# Altium project Computer_Board.PrjPcb (part 3 of 3)
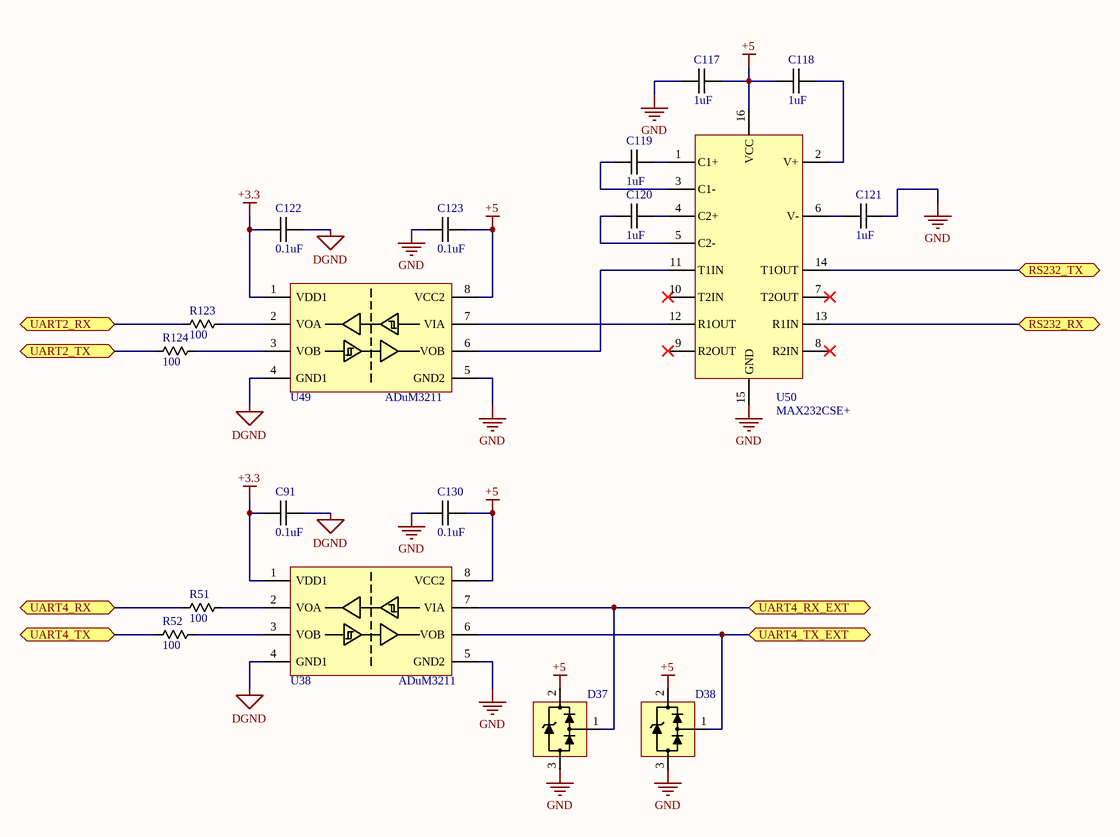
[diagram p13: SCH13_RS232.SchDoc]

## Nets that join several sheets
+3.3: SCH1_Power (C17.1 C18.1 L4.2 R7.1), SCH2_Main_Computer (12 pins), SCH3_Main_Computer_Eth (13 pins), SCH4_Main_Computer_USB (U13.5 U16.5), SCH5_Main_computer_USB2-0 (U20.5 U21.5 U22.5 U23.5), SCH6_Main_computer_Display (9 pins), SCH7_Main_Computer_PCIe (12 pins), SCH8_BBB (17 pins), SCH9_BBB_Eth (5 pins), SCH10_BBB_USB (C86.1 R81.1 U34.5), SCH11_Digital_IO (21 pins), SCH12_AFE (C95.2 C102.2 U43.5 U44.1), SCH13_RS232 (C91.2 C122.2 U38.1 U49.1)
+5: SCH1_Power (10 pins), SCH11_Digital_IO (22 pins), SCH12_AFE (23 pins), SCH13_RS232 (9 pins)
+5_SBY: SCH1_Power (5 pins), SCH2_Main_Computer (J3.B84 J3.B85 J3.B86 J3.B87), SCH4_Main_Computer_USB (C32.2 R27.1 R28.1 U14.2), SCH5_Main_computer_USB2-0 (C38.2 C39.2 U18.2 U19.2), SCH6_Main_computer_Display (F2.2 R39.2 R42.2), SCH8_BBB (MOD1.A4 MOD1.A5 MOD1.B5), SCH10_BBB_USB (C83.1 U33.2)
+12: SCH1_Power (6 pins), SCH2_Main_Computer (13 pins)
DGND: SCH1_Power (29 pins), SCH2_Main_Computer (49 pins), SCH3_Main_Computer_Eth (11 pins), SCH4_Main_Computer_USB (25 pins), SCH5_Main_computer_USB2-0 (28 pins), SCH6_Main_computer_Display (28 pins), SCH7_Main_Computer_PCIe (15 pins), SCH8_BBB (58 pins), SCH9_BBB_Eth (21 pins), SCH10_BBB_USB (12 pins), SCH11_Digital_IO (21 pins), SCH12_AFE (5 pins), SCH13_RS232 (C91.1 C122.1 U38.4 U49.4)
GND: SCH1_Power (42 pins), SCH11_Digital_IO (19 pins), SCH12_AFE (39 pins), SCH13_RS232 (9 pins)
ADC_1_~{CS}: SCH11_Digital_IO (U37.14), SCH12_AFE (U43.1 U44.6)
AFE_MUX_0: SCH8_BBB (MOD1.159), SCH12_AFE (U44.7)
AFE_MUX_1: SCH8_BBB (MOD1.158), SCH12_AFE (U44.8)
BBB_I2C_SCL: SCH8_BBB (MOD1.72), SCH11_Digital_IO (R109.1 U40.3)
BBB_I2C_SDA: SCH8_BBB (MOD1.71), SCH11_Digital_IO (R108.1 U40.2)
BBB_SYS_RSTn: SCH8_BBB (MOD1.48), SCH9_BBB_Eth (U31.19)
BBB_USB1_D_N: SCH8_BBB (MOD1.92), SCH10_BBB_USB (T11.4)
BBB_USB1_D_P: SCH8_BBB (MOD1.91), SCH10_BBB_USB (T11.1)
BBB_USB1_VBUS: SCH8_BBB (MOD1.109), SCH10_BBB_USB (C84.1 C85.2 L21.2 U33.7)
CAN_RX: SCH8_BBB (MOD1.74), SCH11_Digital_IO (U35.3)
CAN_TX: SCH8_BBB (MOD1.73), SCH11_Digital_IO (U35.6)
CANH: SCH1_Power (J2.B5), SCH11_Digital_IO (D24.2 R84.1 U35.13)
CANL: SCH1_Power (J2.B6), SCH11_Digital_IO (D25.2 R87.2 U35.12)
CB_RESET#: SCH2_Main_Computer (J3.B50), SCH6_Main_computer_Display (R37.1), SCH7_Main_Computer_PCIe (U28.6)
CRITICAL_TEMP: SCH8_BBB (MOD1.153), SCH11_Digital_IO (R106.2 U41.6)
CRS_DV: SCH8_BBB (MOD1.28), SCH9_BBB_Eth (RN2.2)
CS_MUX_0: SCH8_BBB (MOD1.150), SCH11_Digital_IO (R94.1 U37.1)
CS_MUX_1: SCH8_BBB (MOD1.149), SCH11_Digital_IO (R95.1 U37.2)
CS_MUX_2: SCH8_BBB (MOD1.148), SCH11_Digital_IO (R96.1 U37.3)
DDC_AUX_SEL: SCH2_Main_Computer (J3.B95), SCH6_Main_computer_Display (R43.1)
EN_USB_5V: SCH4_Main_Computer_USB (6 pins), SCH5_Main_computer_USB2-0 (U18.3 U18.4 U19.3 U19.4)
ESTOP_IN_24V: SCH1_Power (J2.B21), SCH12_AFE (R105.2)
ESTOP_STATE: SCH8_BBB (MOD1.137), SCH12_AFE (U44.9)
ETH_CT: SCH2_Main_Computer (J3.A14), SCH3_Main_Computer_Eth (5 pins)
EXCD0_PERST#: SCH2_Main_Computer (J3.A48), SCH7_Main_Computer_PCIe (R47.1)
GBE_ACT#: SCH2_Main_Computer (J3.B2), SCH3_Main_Computer_Eth (R26.2 U11.3 U11.6)
HDMIX_CTRLCLK: SCH2_Main_Computer (J3.B98), SCH6_Main_computer_Display (R41.2 U25.7)
HDMIX_CTRLDATA: SCH2_Main_Computer (J3.B99), SCH6_Main_computer_Display (R38.2 U25.6)
HDMIX_HPD: SCH2_Main_Computer (J3.B89), SCH6_Main_computer_Display (R35.2)
I2C_SCL_EXT: SCH1_Power (J2.B23), SCH11_Digital_IO (D33.1 U40.6)
I2C_SDA_EXT: SCH1_Power (J2.B22), SCH11_Digital_IO (D32.1 U40.7)
LD_CELL_A_GND: SCH1_Power (J2.A15), SCH12_AFE (J14.2 U48.4)
LD_CELL_A_PWR: SCH1_Power (J2.C15 J2.C16), SCH12_AFE (F8.2 U46.4)
LD_CELL_A_REF: SCH1_Power (J2.B15), SCH12_AFE (R111.2)
LD_CELL_A_SNS: SCH1_Power (J2.B16), SCH12_AFE (R113.2)
LD_CELL_B_GND: SCH1_Power (J2.A17), SCH12_AFE (J15.2 U48.5)
LD_CELL_B_PWR: SCH1_Power (J2.C17 J2.C18), SCH12_AFE (F9.2 U46.5)
LD_CELL_B_REF: SCH1_Power (J2.B17), SCH12_AFE (R116.2)
LD_CELL_B_SNS: SCH1_Power (J2.B18), SCH12_AFE (R118.2)
LIMIT_1: SCH1_Power (J2.B7), SCH11_Digital_IO (R85.2)
LIMIT_2: SCH1_Power (J2.B8), SCH11_Digital_IO (R86.2)
LIMIT_3: SCH1_Power (J2.B9), SCH11_Digital_IO (R88.2)
LIMIT_4: SCH1_Power (J2.B10), SCH11_Digital_IO (R89.2)
LIMIT_5: SCH1_Power (J2.B11), SCH11_Digital_IO (R97.2)
LIMIT_6: SCH1_Power (J2.B12), SCH11_Digital_IO (R98.2)
LIMIT_7: SCH1_Power (J2.B13), SCH11_Digital_IO (R99.2)
LIMIT_8: SCH1_Power (J2.B14), SCH11_Digital_IO (R100.2)
LIMIT_SIG_1: SCH8_BBB (MOD1.37), SCH11_Digital_IO (R93.1 U36.9)
LIMIT_SIG_2: SCH8_BBB (MOD1.139), SCH11_Digital_IO (R92.1 U36.11)
LIMIT_SIG_3: SCH8_BBB (MOD1.160), SCH11_Digital_IO (R91.1 U36.13)
LIMIT_SIG_4: SCH8_BBB (MOD1.88), SCH11_Digital_IO (R90.1 U36.15)
LIMIT_SIG_5: SCH8_BBB (MOD1.86), SCH11_Digital_IO (R101.1 U39.15)
LIMIT_SIG_6: SCH8_BBB (MOD1.76), SCH11_Digital_IO (R102.1 U39.13)
LIMIT_SIG_7: SCH8_BBB (MOD1.163), SCH11_Digital_IO (R103.1 U39.11)
LIMIT_SIG_8: SCH8_BBB (MOD1.138), SCH11_Digital_IO (R104.1 U39.9)
LINK100#: SCH2_Main_Computer (J3.A4), SCH3_Main_Computer_Eth (R23.2 U8.2 U10.1)
LINK1000#: SCH2_Main_Computer (J3.A5), SCH3_Main_Computer_Eth (R24.2 U9.2 U10.3)
LINK#: SCH2_Main_Computer (J3.A8), SCH3_Main_Computer_Eth (R25.2 U10.6)
MDI0_N: SCH2_Main_Computer (J3.A12), SCH3_Main_Computer_Eth (J5.10 U7.5 U7.6)
MDI0_P: SCH2_Main_Computer (J3.A13), SCH3_Main_Computer_Eth (J5.11 U7.4 U7.7)
MDI1_N: SCH2_Main_Computer (J3.A9), SCH3_Main_Computer_Eth (J5.5 U7.2 U7.9)
MDI1_P: SCH2_Main_Computer (J3.A10), SCH3_Main_Computer_Eth (J5.4 U7.1 U7.10)
MDI2_N: SCH2_Main_Computer (J3.A6), SCH3_Main_Computer_Eth (J5.2 U6.2 U6.9)
MDI2_P: SCH2_Main_Computer (J3.A7), SCH3_Main_Computer_Eth (J5.3 U6.1 U6.10)
MDI3_N: SCH2_Main_Computer (J3.A2), SCH3_Main_Computer_Eth (J5.9 U6.5 U6.6)
MDI3_P: SCH2_Main_Computer (J3.A3), SCH3_Main_Computer_Eth (J5.8 U6.4 U6.7)
MDIO_CLK: SCH8_BBB (MOD1.20), SCH9_BBB_Eth (U31.17)
MDIO_DATA: SCH8_BBB (MOD1.19), SCH9_BBB_Eth (R73.2 U31.16)
MII1_COL: SCH8_BBB (MOD1.12), SCH9_BBB_Eth (RN2.3)
OVER_TEMP: SCH8_BBB (MOD1.134), SCH11_Digital_IO (R107.2 U41.5)
PCIE_CLK_N: SCH2_Main_Computer (J3.A88), SCH7_Main_Computer_PCIe (J10.49)
PCIE_CLK_P: SCH2_Main_Computer (J3.A89), SCH7_Main_Computer_PCIe (J10.47)
PCIE_CLKREQ0#: SCH2_Main_Computer (J3.A49), SCH7_Main_Computer_PCIe (J10.53)
PCIE_RX0_N: SCH2_Main_Computer (J3.B68), SCH7_Main_Computer_PCIe (J10.41)
PCIE_RX0_P: SCH2_Main_Computer (J3.B69), SCH7_Main_Computer_PCIe (J10.43)
PCIE_TX0_N: SCH2_Main_Computer (J3.A68), SCH7_Main_Computer_PCIe (J10.35)
PCIE_TX0_P: SCH2_Main_Computer (J3.A69), SCH7_Main_Computer_PCIe (J10.37)
PCIE_WAKE0#: SCH2_Main_Computer (J3.B66), SCH7_Main_Computer_PCIe (J10.55 R46.2)
PORT_POT_GND: SCH1_Power (J2.A19), SCH12_AFE (J16.2 U48.6)
PORT_POT_PWR: SCH1_Power (J2.C19), SCH12_AFE (F10.2 U46.6)
PORT_POT_SNS: SCH1_Power (J2.B19), SCH12_AFE (R119.2)
RS232_RX: SCH1_Power (J2.C22), SCH13_RS232 (U50.13)
RS232_TX: SCH1_Power (J2.C21), SCH13_RS232 (U50.14)
RX_DV: SCH8_BBB (MOD1.9), SCH9_BBB_Eth (R74.1)
RXCLK: SCH8_BBB (MOD1.6), SCH9_BBB_Eth (R75.1)
RXD0: SCH8_BBB (MOD1.21), SCH9_BBB_Eth (RN1.4)
RXD1: SCH8_BBB (MOD1.22), SCH9_BBB_Eth (RN1.3)
RXD2: SCH8_BBB (MOD1.4), SCH9_BBB_Eth (RN1.2)
RXD3: SCH8_BBB (MOD1.5), SCH9_BBB_Eth (RN1.1)
RXERR: SCH8_BBB (MOD1.27), SCH9_BBB_Eth (RN2.1)
SMB_ALERT#: SCH2_Main_Computer (J3.B15), SCH7_Main_Computer_PCIe (R50.1)
SMB_CLK: SCH2_Main_Computer (J3.B13), SCH7_Main_Computer_PCIe (R49.1)
SMB_DATA: SCH2_Main_Computer (J3.B14), SCH7_Main_Computer_PCIe (R48.1)
SPI_CLK: SCH8_BBB (MOD1.103 P4.2), SCH11_Digital_IO (U41.1), SCH12_AFE (U44.3)
SPI_CS0: SCH8_BBB (MOD1.106), SCH11_Digital_IO (U37.4 U37.5)
SPI_CS_EXT: SCH8_BBB (P4.5), SCH11_Digital_IO (U37.15)
SPI_MISO: SCH8_BBB (MOD1.104 P4.4), SCH11_Digital_IO (U41.2), SCH12_AFE (U43.4)
SPI_MOSI: SCH8_BBB (MOD1.105 P4.3), SCH11_Digital_IO (U41.3), SCH12_AFE (U44.4)
STBD_POT_GND: SCH1_Power (J2.A20), SCH12_AFE (J17.2 U48.7)
STBD_POT_PWR: SCH1_Power (J2.C20), SCH12_AFE (F11.2 U46.7)
STBD_POT_SNS: SCH1_Power (J2.B20), SCH12_AFE (R122.2)
TMDSX_CLK_N: SCH2_Main_Computer (J3.B82), SCH6_Main_computer_Display (C51.1)
TMDSX_CLK_P: SCH2_Main_Computer (J3.B81), SCH6_Main_computer_Display (C50.1)
TMDSX_DATA0_N: SCH2_Main_Computer (J3.B76), SCH6_Main_computer_Display (C53.1)
TMDSX_DATA0_P: SCH2_Main_Computer (J3.B75), SCH6_Main_computer_Display (C52.1)
TMDSX_DATA1_N: SCH2_Main_Computer (J3.B74), SCH6_Main_computer_Display (C57.1)
TMDSX_DATA1_P: SCH2_Main_Computer (J3.B73), SCH6_Main_computer_Display (C56.1)
TMDSX_DATA2_N: SCH2_Main_Computer (J3.B72), SCH6_Main_computer_Display (C59.1)
TMDSX_DATA2_P: SCH2_Main_Computer (J3.B71), SCH6_Main_computer_Display (C58.1)
TXCLK: SCH8_BBB (MOD1.23), SCH9_BBB_Eth (R76.1)
TXD0: SCH8_BBB (MOD1.24), SCH9_BBB_Eth (U31.22)
TXD1: SCH8_BBB (MOD1.7), SCH9_BBB_Eth (U31.23)
TXD2: SCH8_BBB (MOD1.25), SCH9_BBB_Eth (U31.24)
TXD3: SCH8_BBB (MOD1.8), SCH9_BBB_Eth (U31.25)
TXEN: SCH8_BBB (MOD1.10), SCH9_BBB_Eth (U31.21)
UART2_RX: SCH8_BBB (MOD1.69), SCH13_RS232 (R123.1)
UART2_TX: SCH8_BBB (MOD1.70), SCH13_RS232 (R124.1)
UART4_RX: SCH8_BBB (MOD1.36), SCH13_RS232 (R51.1)
UART4_RX_EXT: SCH1_Power (J2.C24), SCH13_RS232 (D37.1 U38.7)
UART4_TX: SCH8_BBB (MOD1.35), SCH13_RS232 (R52.1)
UART4_TX_EXT: SCH1_Power (J2.C23), SCH13_RS232 (D38.1 U38.6)
USB0_N: SCH2_Main_Computer (J3.A45), SCH4_Main_Computer_USB (T1.1)
USB0_P: SCH2_Main_Computer (J3.A46), SCH4_Main_Computer_USB (T1.4)
USB1_DRVVBUS: SCH8_BBB (MOD1.107), SCH10_BBB_USB (R82.1 U33.3)
USB1_N: SCH2_Main_Computer (J3.B45), SCH4_Main_Computer_USB (T4.1)
USB1_OCn: SCH8_BBB (MOD1.93), SCH10_BBB_USB (R81.2 U33.8)
USB1_P: SCH2_Main_Computer (J3.B46), SCH4_Main_Computer_USB (T4.4)
USB2_N: SCH2_Main_Computer (J3.A42), SCH5_Main_computer_USB2-0 (T7.4)
USB2_P: SCH2_Main_Computer (J3.A43), SCH5_Main_computer_USB2-0 (T7.1)
USB3_N: SCH2_Main_Computer (J3.B42), SCH5_Main_computer_USB2-0 (T9.4)
USB3_P: SCH2_Main_Computer (J3.B43), SCH5_Main_computer_USB2-0 (T9.1)
USB4_N: SCH2_Main_Computer (J3.A39), SCH5_Main_computer_USB2-0 (T8.4)
USB4_P: SCH2_Main_Computer (J3.A40), SCH5_Main_computer_USB2-0 (T8.1)
USB5_N: SCH2_Main_Computer (J3.B39), SCH5_Main_computer_USB2-0 (T10.4)
USB5_P: SCH2_Main_Computer (J3.B40), SCH5_Main_computer_USB2-0 (T10.1)
USB6_N: SCH2_Main_Computer (J3.A36), SCH8_BBB (J1.2)
USB6_P: SCH2_Main_Computer (J3.A37), SCH8_BBB (J18.1)
USB7_N: SCH2_Main_Computer (J3.B36), SCH7_Main_Computer_PCIe (J10.5)
USB7_P: SCH2_Main_Computer (J3.B37), SCH7_Main_Computer_PCIe (J10.3)
USB_0_1_OC#: SCH2_Main_Computer (J3.B44), SCH4_Main_Computer_USB (Q5.1 R29.1 U14.5 U14.8)
USB_2_3_OC#: SCH2_Main_Computer (J3.A44), SCH5_Main_computer_USB2-0 (U18.5 U18.8)
USB_4_5_OC#: SCH2_Main_Computer (J3.B38), SCH5_Main_computer_USB2-0 (U19.5 U19.8)
USB_SSRX0_N: SCH2_Main_Computer (J3.A22), SCH4_Main_Computer_USB (T2.1)
USB_SSRX0_P: SCH2_Main_Computer (J3.A23), SCH4_Main_Computer_USB (T2.4)
USB_SSRX1_N: SCH2_Main_Computer (J3.A25), SCH4_Main_Computer_USB (T5.1)
USB_SSRX1_P: SCH2_Main_Computer (J3.A26), SCH4_Main_Computer_USB (T5.4)
USB_SSTX0_N: SCH2_Main_Computer (J3.B22), SCH4_Main_Computer_USB (T3.1)
USB_SSTX0_P: SCH2_Main_Computer (J3.B23), SCH4_Main_Computer_USB (T3.4)
USB_SSTX1_N: SCH2_Main_Computer (J3.B25), SCH4_Main_Computer_USB (T6.1)
USB_SSTX1_P: SCH2_Main_Computer (J3.B26), SCH4_Main_Computer_USB (T6.4)